# EAGLE schematic Motor_V05 (EAGLE 9.2.2)
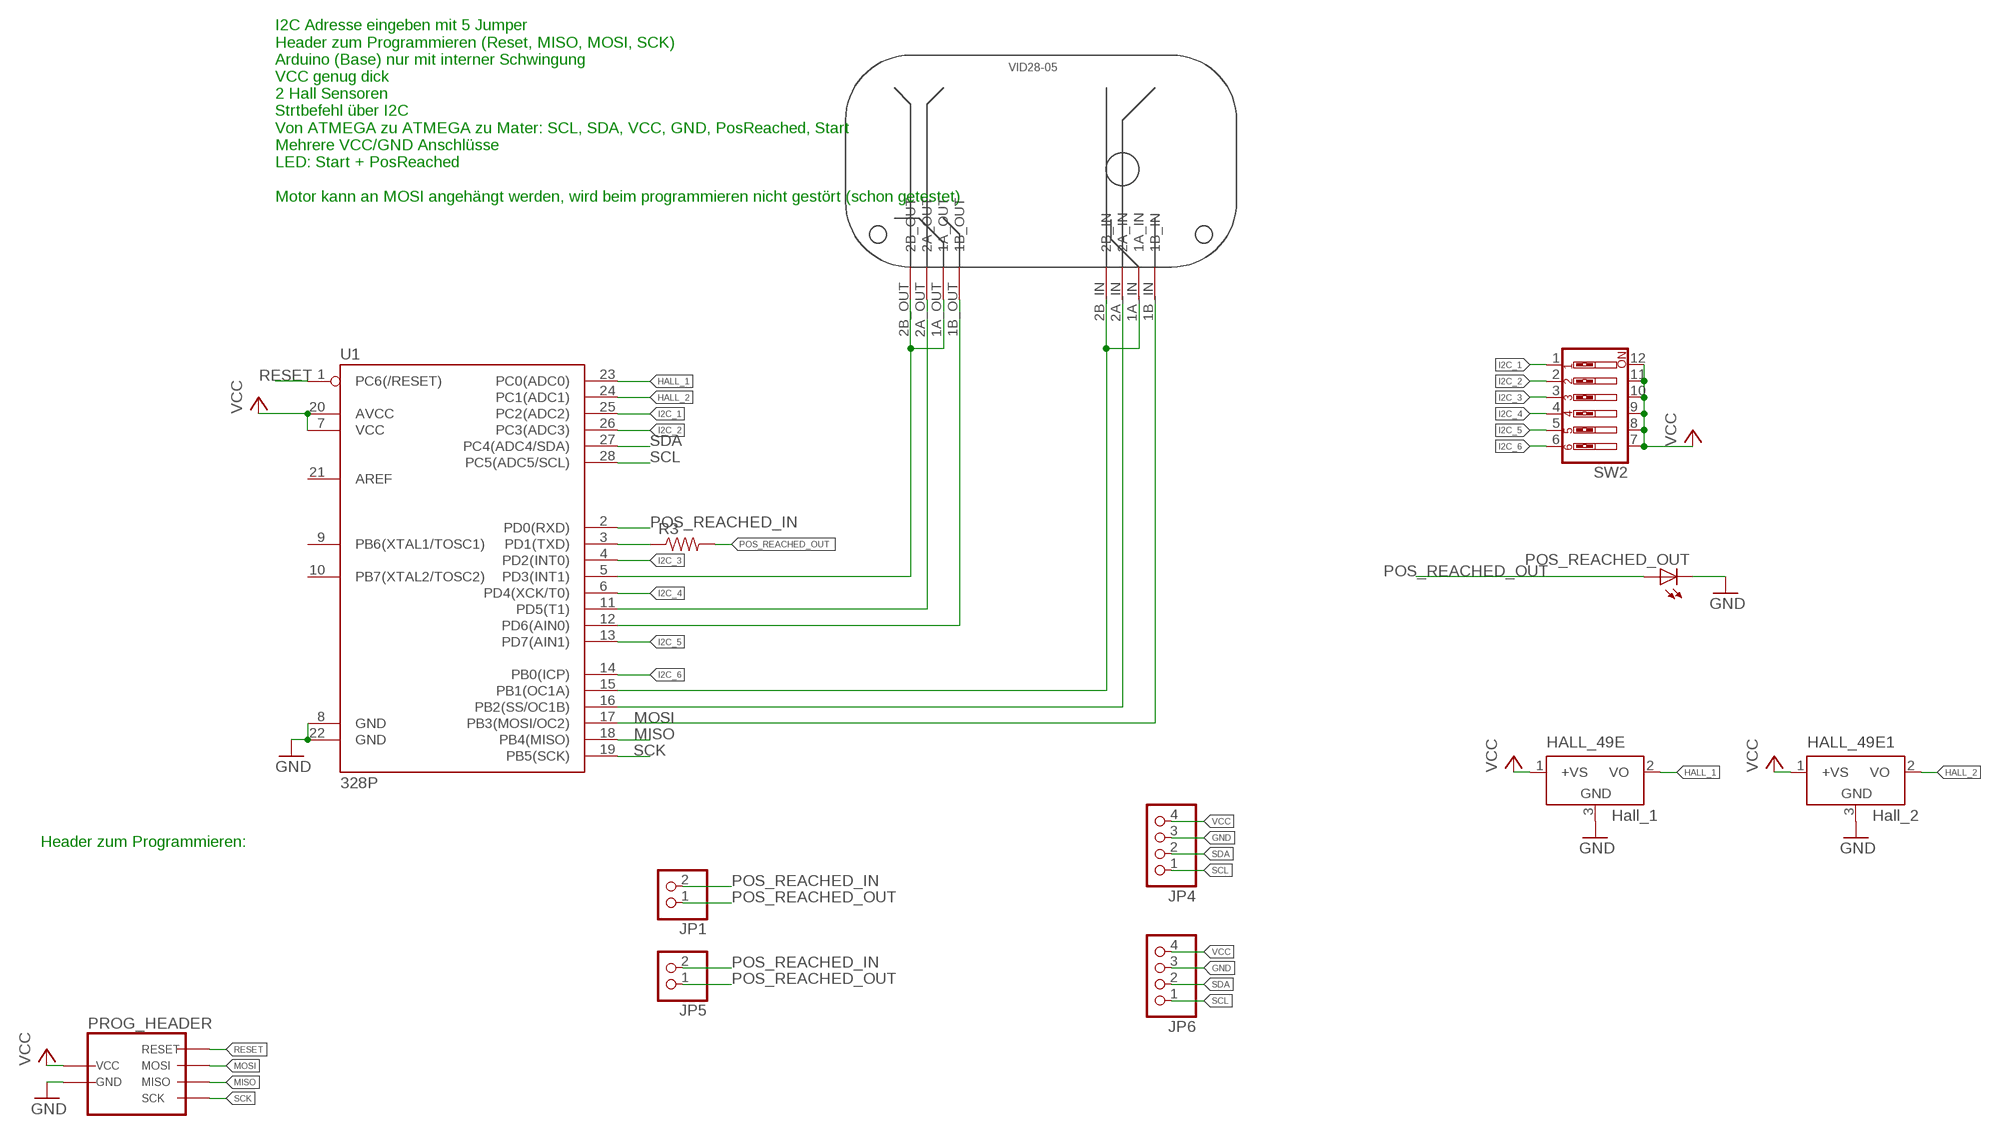
[diagram p0: schematic, sheet 1]

## Parts
HALL_49E  Hall_1  LM50  [SOT23]
HALL_49E1  Hall_2  LM50  [SOT23]
JP1  PINHD-1X2  [1X02]
JP3  ATMEGA_PROGRAM_HEADER  [ATMEGA_PROGRAM_HEADER]
JP4  PINHD-1X4  [1X04]
JP5  PINHD-1X2  [1X02]
JP6  PINHD-1X4  [1X04]
POS_REACHED_OUT  LED_ELD260  [LED_LD260]
R3  SPARKFUN_RESISTORAXIAL-0.3  [SPARKFUN_AXIAL-0.3]
SW2  SW_DIP-6  [EDG-06]
U1  328P  ATMEGA328P_PDIP  [DIP28]
U$4  VID28-05  [VID28-05]

## Nets
GND [Leistung]: HALL_49E1.3(GND) HALL_49E.3(GND) JP3.GND JP4.3 JP6.3 POS_REACHED_OUT.K(C) U1.8(GND) U1.22(GND)
HALL_1: HALL_49E.2(VO) U1.23(PC0(ADC0))
HALL_2: HALL_49E1.2(VO) U1.24(PC1(ADC1))
I2C_1: SW2.1 U1.25(PC2(ADC2))
I2C_2: SW2.2 U1.26(PC3(ADC3))
I2C_3: SW2.3 U1.4(PD2(INT0))
I2C_4: SW2.4 U1.6(PD4(XCK/T0))
I2C_5: SW2.5 U1.13(PD7(AIN1))
I2C_6: SW2.6 U1.14(PB0(ICP))
MISO: JP3.MISO U1.18(PB4(MISO))
MOSI: JP3.MOSI U1.17(PB3(MOSI/OC2)) U$4.1B_IN
N$2: U1.15(PB1(OC1A)) U$4.1A_IN U$4.2B_IN
N$3: U1.16(PB2(SS/OC1B)) U$4.2A_IN
N$4: U1.12(PD6(AIN0)) U$4.1B_OUT
N$5: U1.11(PD5(T1)) U$4.2A_OUT
N$9: U1.5(PD3(INT1)) U$4.1A_OUT U$4.2B_OUT
N$14: R3.P$1 U1.3(PD1(TXD))
POS_REACHED_IN: JP1.2 JP5.2 U1.2(PD0(RXD))
POS_REACHED_OUT: JP1.1 JP5.1 POS_REACHED_OUT.A R3.P$2
RESET: JP3.RESET U1.1(PC6(/RESET))
SCK: JP3.SCK U1.19(PB5(SCK))
SCL: JP4.1 JP6.1 U1.28(PC5(ADC5/SCL))
SDA: JP4.2 JP6.2 U1.27(PC4(ADC4/SDA))
VCC [Leistung]: HALL_49E1.1(+VS) HALL_49E.1(+VS) JP3.VCC JP4.4 JP6.4 SW2.7 SW2.8 SW2.9 SW2.10 SW2.11 SW2.12 U1.7(VCC) U1.20(AVCC)
Unconnected: U1.9(PB6(XTAL1/TOSC1)) U1.10(PB7(XTAL2/TOSC2)) U1.21(AREF)

## Notes on the sheet
- I2C Adresse eingeben mit 5 Jumper
  Header zum Programmieren (Reset, MISO, MOSI, SCK)
  Arduino (Base) nur mit interner Schwingung
  VCC genug dick
  2 Hall Sensoren
  Strtbefehl über I2C
  Von ATMEGA zu ATMEGA zu Mater: SCL, SDA, VCC, GND, PosReached, Start
  Mehrere VCC/GND Anschlüsse
  LED: Start + PosReached
  
  Motor kann an MOSI angehängt werden, wird beim programmieren nicht gestört (schon getestet)
- Header zum Programmieren:

## Library data of the parts
HALL_49E HALL_49E1 = linear:LM50: SOT-23 Single-Supply Centigrade Temperature Sensor Vout = (10mV/°C x Temp °C) +5mmmV Source: http://cache.national.com/ds/LM/LM50.pdf
JP1 JP5 = pinhead:PINHD-1X2: PIN HEADER
JP3 = Olivier_Own_Libraries:ATMEGA_PROGRAM_HEADER: PIN HEADER
JP4 JP6 = pinhead:PINHD-1X4: PIN HEADER
POS_REACHED_OUT = eagle-ltspice:LED_E: LED Source: http://www.osram.convergy.de Source: www.luxeon.com Source: www.kingbright.com; SPICEMODEL: NONE; SPICEPREFIX: D; SPICETYPE: diode
R3 = SparkFun_Pro_Micro_v13a:SPARKFUN_RESISTOR: Resistor Basic schematic elements and footprints for 0603, 1206, and PTH resistors.
SW2 = special:SW_DIP-6: DIP SWITCH
U1 = SparkFun-IC-Microcontroller:ATMEGA328P_PDIP: Atmel 328P Through hole ATMEGA328P uC used in the Arduino 32kb flash, 1k EEPROM, 2k SRAM Datasheet <http://www.sparkfun.com/datasheets/Components/SMD/ATMega328.pdf> SparkFun Products Storefront component: AVR 28 Pin 20MHz 32K 6A/D - ATMega328P <https://www.sparkfun.com/products/9061> (COM-09061) SparkFun Simon Says - Through-Hole Soldering Kit <https://www.sparkfun.com/products/10547> (KIT-10547) SparkFun Learn to Solder - Simon Says <https://www.sparkfun.com/products/13708> (KIT-13708) SparkFun BigTime Watch Kit <https://www.sparkfun.com/products/11734> (KIT-11734) SparkFun ClockIt <https://www.sparkfun.com/products/10930> (KIT-10930) SparkFun Serial Enabled LCD Kit <https://www.sparkfun.com/products/10097> (LCD-10097) SparkFun Simon Tilts - Through Hole Soldering Kit <https://www.sparkfun.com/products/12634> (KIT-12634) SparkFun Frequency Counter Kit <https://www.sparkfun.com/products/10140> (KIT-10140) FabFM Radio Kit <https://www.sparkfun.com/products/11043> (KIT-11043) SparkFun Binary Blaster Kit <https://www.sparkfun.com/products/12037> (KIT-12037) SparkFun Metro-Gnome <https://www.sparkfun.com/products/9236> (KIT-09236) ATmega328 with Arduino Optiboot (Uno) <https://www.sparkfun.com/products/10524> (DEV-10524); PROD_ID: IC-09136
U$4 = MegaProMini:VID28-05

## Net classes
0 default: width 0.203 mm
1 Leistung: width 0.508 mm